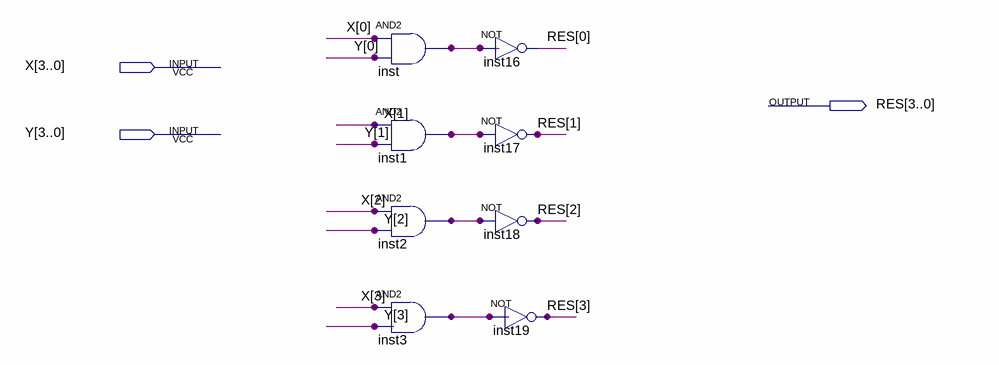
[diagram p0: schematic sheet]
// Quartus schematic nand_block4.bdf as structural Verilog: 8 symbols, 3 pins
module nand_block4 (
  input  [3:0] X,
  input  [3:0] Y,
  output [3:0] RES
);

  wire inst1_out, inst2_out, inst3_out, inst_out;

  and inst (inst_out, X[0], Y[0]);
  and inst1 (inst1_out, X[1], Y[1]);
  and inst2 (inst2_out, X[2], Y[2]);
  and inst3 (inst3_out, X[3], Y[3]);
  not inst16 (RES[0], inst_out);
  not inst17 (RES[1], inst1_out);
  not inst18 (RES[2], inst2_out);
  not inst19 (RES[3], inst3_out);
endmodule
